# EAGLE design Current_sensor_V1.1 (EAGLE 5.11)
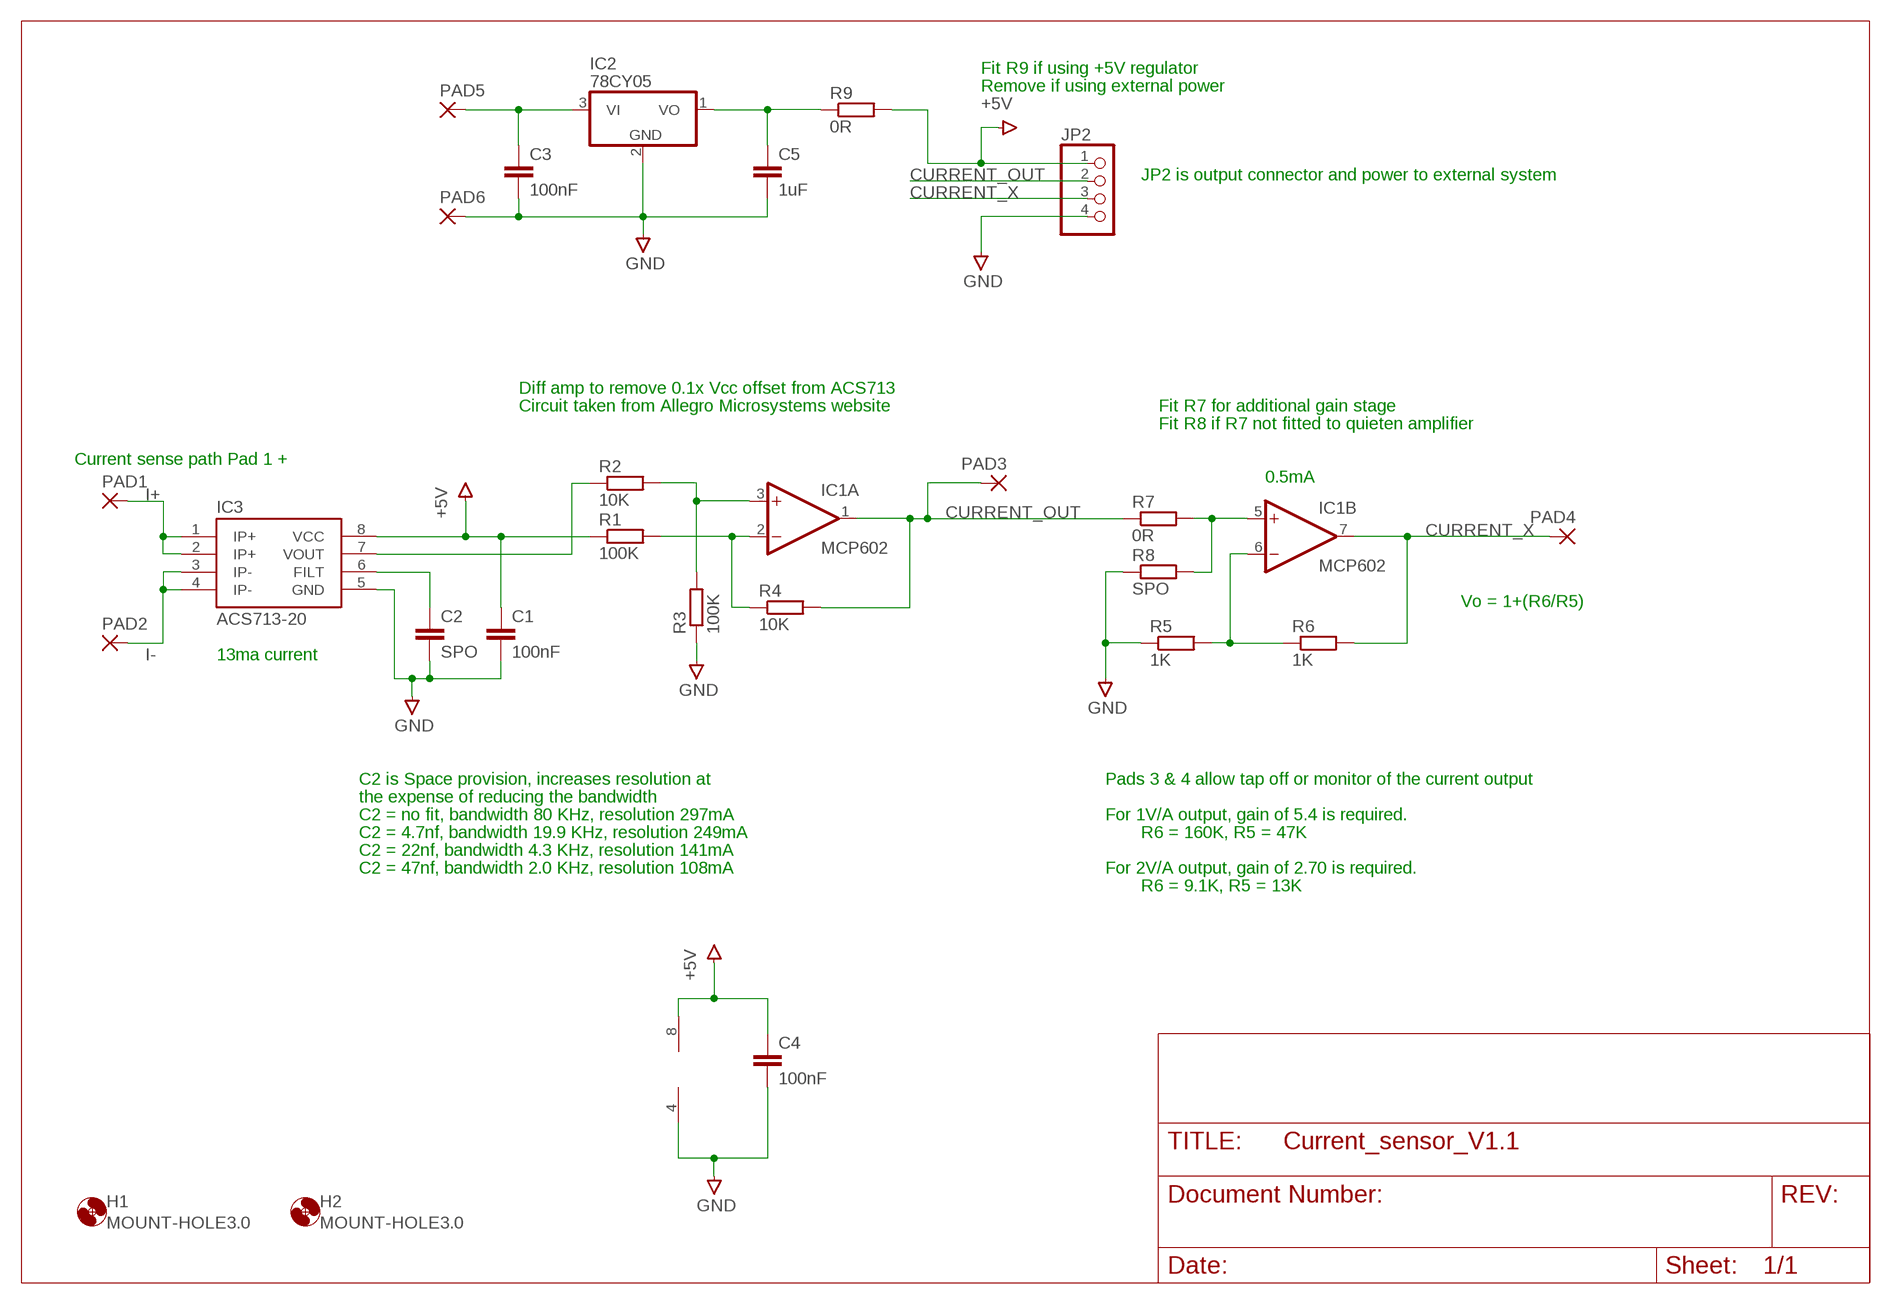
[diagram p0: schematic, sheet 1]

## Parts
C1  100nF  C-EUC0603  [C0603]
C2  SPO  C-EUC0603  [C0603]
C3  100nF  C-EUC0805  [C0805]
C4  100nF  C-EUC0603  [C0603]
C5  1uF  C-EUC0805  [C0805]
H1  MOUNT-HOLE3.0  [3,0]
H2  MOUNT-HOLE3.0  [3,0]
IC1  MCP602  LM358D  [SO08]
IC2  78CY05  78CY  [SOT89]
IC3  ACS713-20  ACS712  [SO08]
JP2  PINHD-1X4  [1X04]
PAD1  3,81/1,4  [3,81/1,4]
PAD2  3,81/1,4  [3,81/1,4]
PAD3  1,6/0,9  [1,6/0,9]
PAD4  1,6/0,9  [1,6/0,9]
PAD5  1,6/0,9  [1,6/0,9]
PAD6  1,6/0,9  [1,6/0,9]
R1  100K  R-EU_R0603  [R0603]
R2  10K  R-EU_R0603  [R0603]
R3  100K  R-EU_R0603  [R0603]
R4  10K  R-EU_R0603  [R0603]
R5  1K  R-EU_R0603  [R0603]
R6  1K  R-EU_R0603  [R0603]
R7  0R  R-EU_R0603  [R0603]
R8  SPO  R-EU_R0603  [R0603]
R9  0R  R-EU_R0805  [R0805]

## Nets
+5V: C1.1 C4.1 IC1.8(P:V+) IC3.8(VCC) JP2.1 R1.1 R9.2
CURRENT_OUT: IC1.1(A:OUT) JP2.2 PAD3.1(P) R4.2 R7.1
CURRENT_X: IC1.7(B:OUT) JP2.3 PAD4.1(P) R6.2
GND: C1.2 C2.2 C3.2 C4.2 C5.2 IC1.4(P:V-) IC2.2(GND) IC3.5(GND) JP2.4 PAD6.1(P) R3.1 R5.1 R8.1
I+: IC3.1(IP+) IC3.2(IP+) PAD1.1(P)
I-: IC3.3(IP-) IC3.4(IP-) PAD2.1(P)
N$1: IC1.2(A:-IN) R1.2 R4.1
N$2: IC1.3(A:+IN) R2.2 R3.2
N$3: C5.1 IC2.1(VO) R9.1
N$4: IC1.5(B:+IN) R7.2 R8.2
N$5: IC3.7(VOUT) R2.1
N$7: C2.1 IC3.6(FILT)
N$10: IC1.6(B:-IN) R5.2 R6.1
N$14: C3.1 IC2.3(VI) PAD5.1(P)

## Notes on the sheet
- Fit R9 if using +5V regulator
- Remove if using external power
- JP2 is output connector and power to external system
- Diff amp to remove 0.1x Vcc offset from ACS713
- Circuit taken from Allegro Microsystems website | Fit R7 for additional gain stage
- Fit R8 if R7 not fitted to quieten amplifier
- Current sense path Pad 1 +
- 0.5mA
- Vo = 1+(R6/R5)
- 13ma current
- C2 is Space provision, increases resolution at | Pads 3 & 4 allow tap off or monitor of the current output
- the expense of reducing the bandwidth
- C2 = no fit, bandwidth 80 KHz, resolution 297mA | For 1V/A output, gain of 5.4 is required.
- C2 = 4.7nf, bandwidth 19.9 KHz, resolution 249mA | R6 = 160K, R5 = 47K
- C2 = 22nf, bandwidth 4.3 KHz, resolution 141mA
- C2 = 47nf, bandwidth 2.0 KHz, resolution 108mA | For 2V/A output, gain of 2.70 is required.
- R6 = 9.1K, R5 = 13K

## Library data of the parts
C1-C5 = rcl:C-EU: CAPACITOR, European symbol
H1 H2 = holes:MOUNT-HOLE: MOUNTING HOLE with drill center marker
IC1 = linear2:LM358: OP AMP
IC2 = IANS:78*: Positive VOLTAGE REGULATOR
IC3 = SparkFun:ACS712
JP2 = pinhead:PINHD-1X4: PIN HEADER
PAD1 PAD2 = wirepad:3,81/1,4: THROUGH-HOLE PAD
PAD3-PAD6 = wirepad:1,6/0,9: THROUGH-HOLE PAD
R1-R9 = rcl:R-EU_: RESISTOR, European symbol

## Board
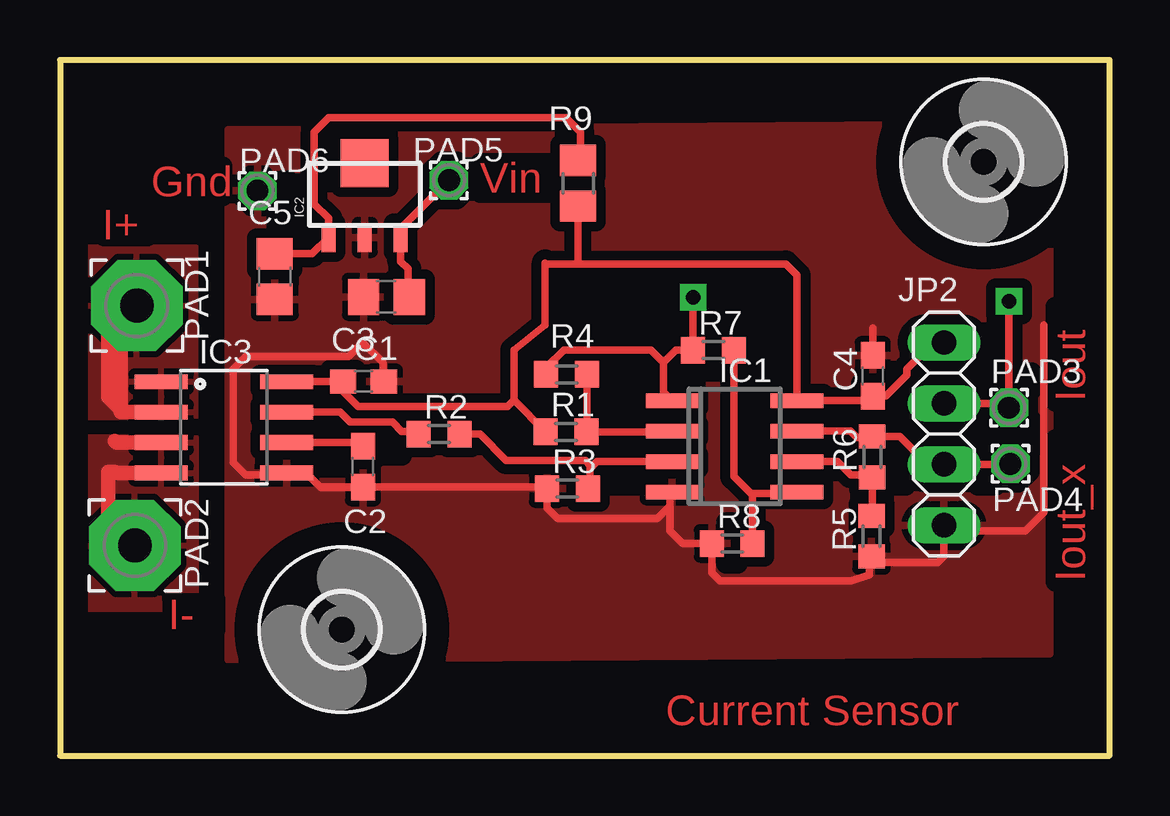
[diagram p1: board, top side]
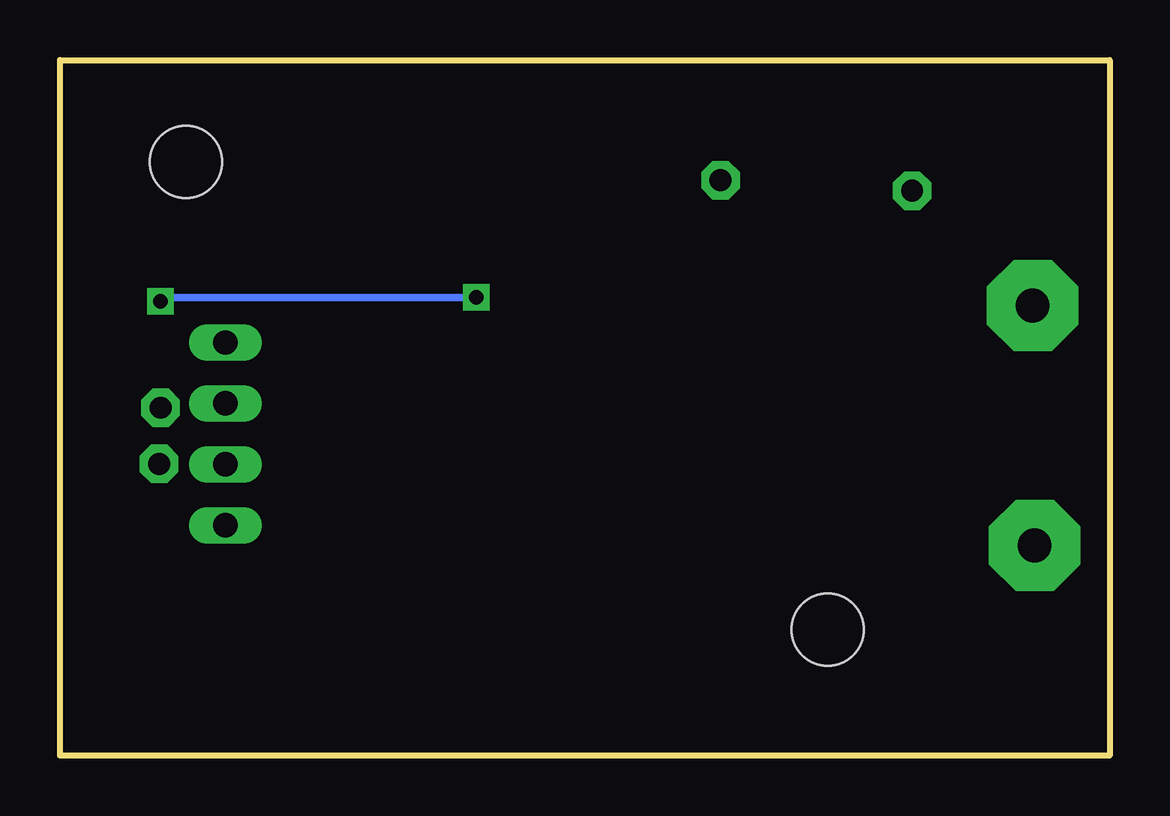
[diagram p2: board, bottom side, seen from below]

Size 43.75 x 29 mm. Coordinates in mm from the lower left corner, seen from the top.
Outline: 0,0 43.75,0 43.75,29 0,29 0,0
Copper layers (1*16): Top 0.035mm / dielectric 1.5mm / Bottom 0.035mm
Design rules "homepcb": minimum track width 10mil, minimum drill 20mil, track to track 10mil, track to pad 10mil, pad to pad 10mil, via to via 10mil, smd to smd 10mil, copper to edge 40mil, drill to drill 10mil, minimum pad ring 10mil, minimum via ring 10mil, stop-mask expansion 0mil, vias tented up to drill 0mil, thermal gap 10mil
tRestrict: area 9,22 to 9.2,22.2; area 9.2,22 to 9.5,24; area 10.8,12.2 to 11.8,12.5; area 10.8,12 to 12,12.2; area 13.5,12.5 to 14.2,12.8; area 22.8,11.2 to 24.2,11.5; area 27,16 to 27.5,16.2; area 34.8,11.2 to 35.2,11.5; area 38.2,11.2 to 39,11.5; area 40.2,12.8 to 40.5,14; area 40.2,15.2 to 40.5,16; area 27.8,8 to 28.2,8.2; 1 more areas

### Footprints (pad centres in the part's own frame; a part is rotated, then mirrored left to right if it is on the bottom)
C0603 = smd 1.1 x 1: 1 -0.85,0; 2 0.85,0
C0805 = smd 1.3 x 1.5: 1 -0.95,0; 2 0.95,0
3,0 = hole 3: 0,0
SO08 = smd 0.6 x 2.2: 1 -1.905,-2.6; 2 -0.635,-2.6; 3 0.635,-2.6; 4 1.905,-2.6; 5 1.905,2.6; 6 0.635,2.6; 7 -0.635,2.6; 8 -1.905,2.6
SOT89 = smd 0.58 x 1.2: 1 -1.5,-1.8; 2 0,-1.8; 3 1.5,-1.8 | smd 2 x 2: 4 0,1.3
SO08' = smd 0.61 x 2.21: 1 -1.905,-2.616; 2 -0.635,-2.616; 3 0.635,-2.616; 4 1.905,-2.616; 5 1.905,2.616; 6 0.635,2.616; 7 -0.635,2.616; 8 -1.905,2.616
1X04 = drill 1.016 long: 1 -3.81,0; 2 -1.27,0; 3 1.27,0; 4 3.81,0
3,81/1,4 = drill 1.397 pad 3.81 octagon: 1 0,0
1,6/0,9 = drill 0.914 pad 1.6 octagon: 1 0,0
R0603 = smd 1 x 1.1: 1 -0.85,0; 2 0.85,0
R0805 = smd 1.3 x 1.5: 1 -0.95,0; 2 0.95,0

### Placement (x,y rotation side)
C1  12.65,15.59 0 top
C2  12.62,12.05 270 top
C3  13.61,19.12 180 top
C4  33.88,15.83 90 top
C5  8.96,19.97 270 top
H1  11.75,5.25 0 top
H2  38.5,24.75 0 top
IC1  28.12,12.89 270 top
IC2  12.7,23.4 0 top
IC3  ACS713-20  [SO08']  6.84,13.68 270 top
JP2  36.85,13.41 270 top
PAD1  3.2,18.76 0 top
PAD2  3.12,8.76 0 top
PAD3  39.56,14.5 0 top
PAD4  39.62,12.16 0 top
PAD5  16.21,23.98 0 top
PAD6  8.23,23.55 0 top
R1  21.09,13.5 0 top
R2  15.8,13.4 0 top
R3  21.15,11.13 0 top
R4  21.12,15.89 180 top
R5  33.83,9.15 90 top
R6  33.86,12.45 90 top
R7  27.24,16.9 0 top
R8  28.02,8.84 0 top
R9  21.6,23.86 270 top

### Tracks (layer width: path | path; a pad name or v marks a point on that pad's centre or on a via)
+5V
  Top 0.305: IC3.8 C1.1 11.8,15.18 12.42,14.56 18.66,14.56 18.92,14.82 | R1.1 18.92,14.82 | 18.92,14.82 18.92,16.9 20.22,17.94 20.22,20.54 20.26,20.5 21.7,20.5 | JP2.1 36.79,17.16 36.34,17.16 35.3,16.12 35.3,15.86 34.42,14.98 C4.1 33.7,14.8 IC1.8 30.72,20.03 30.25,20.5 21.7,20.5 | R9.2 21.6,20.6 21.7,20.5
CURRENT_OUT  (via drill 0.6)
  Top 0.305: 25.16,16.38 25.68,16.9 R7.1 v26.39,19.09 v26.4,19.1 | 25.16,16.38 25.16,15.16 IC1.1 | R4.2 20.27,16.17 21,16.9 24.64,16.9 25.16,16.38 | JP2.2 39.38,14.68 PAD3.1 | PAD3.1 39.7,14.64 | v39.56,18.94 PAD3.1
  Bottom 0.305: v26.4,19.1 39.7,19.1 v39.56,18.94
CURRENT_X
  Top 0.305: IC1.7 32.95,13.52 33.22,13.26 33.82,13.26 R6.2 35,13.3 36.08,12.22 36.77,12.22 JP2.3 39.6,12.14 PAD4.1
GND
  Top 0.305: C1.2 13.46,15.63 13.46,16.38 12.62,17.22 12.04,16.64 7.74,16.64 7.22,16.12 7.22,12.22 7.74,11.7 10.34,11.7 | IC3.5 10.26,11.78 10.34,11.7 | 10.85,11.2 10.86,11.18 12.61,11.18 C2.2 | C2.2 20.23,11.2 R3.1 20.3,10.32 20.74,9.88 24.9,9.88 25.42,10.4 | 25.42,10.4 25.42,10.89 IC1.4 | 25.42,10.4 25.42,9.36 25.94,8.84 R8.1 27.17,7.61 27.5,7.28 32.96,7.28 33.74,7.54 33.74,8.21 R5.1 34.07,8.06 36.6,8.06 36.85,8.31 JP2.4 37.09,9.36 40.24,9.36 41.02,10.14 41.02,17.94 | C4.2 33.88,17.82 | 10.85,11.2 C2.2 | 10.34,11.7 10.85,11.2
  pour Top (isolate 0.406): 7,26.1 41.25,26.35 41.25,4.25 7,4
I+
  Top 0.406: 2.54,14.32 2.5,14.32
  Top 0.61: 2.54,14.32 2.54,18.84 | IC3.2 2.64,14.32 2.02,14.94 2.02,17.58 PAD1.1
  pour Top: 5.66,14.12 5.66,21.18 0.72,21.18 0.72,14.12
I-
  Top 0.406: 3.84,11.78 IC3.4 | IC3.3 4.22,13.12
  Top 0.61: 3.84,11.78 2.32,11.78 2.28,11.82 2.02,11.82 2.02,10 3.06,8.96 3.06,8.44 | IC3.3 2.35,13.05 2.28,13.12
  Top 1.016: 2.28,8.44 3.06,8.44 3.84,8.44
  pour Top: 5.66,13.28 5.66,6.1 0.72,6.1 0.72,13.28
N$1
  Top 0.305: IC1.2 25.49,13.5 R1.2 21.97,13.52 R4.1
N$2
  Top 0.305: R2.2 17.5,13.4 18.6,12.3 21.9,12.3 22.1,12.1 22.1,11.96 | 22.1,11.96 22.1,11.23 R3.2 | IC1.3 22.39,12.25 22.1,11.96
N$3
  Top 0.305: C5.1 10.52,20.92 IC2.1 11.2,22.4 10.6,23 10.6,26 11.2,26.6 21.1,26.6 21.7,26 21.7,24.91 R9.1
N$4
  Top 0.305: R7.2 28.09,11.63 28.8,10.92 | 28.8,10.92 30.66,10.92 IC1.5 | R8.2 28.87,10.85 28.8,10.92
N$5
  Top 0.305: R2.1 14.84,13.52 14.24,13.52 13.86,13.9 12.1,13.9 11.68,14.32 IC3.7
N$7
  Top 0.305: IC3.6 12.47,13.05 C2.1
N$10
  Top 0.305: IC1.6 32.41,12.25 32.96,11.7 33.76,11.7 R6.1 33.86,10.03 R5.2
N$14
  Top 0.305: PAD5.1 14.2,21.97 IC2.3 14.2,20.6 14.5,20.3 14.5,19.48 C3.1

### Text on the board
Top: Gnd | Vin | I+ | Iout | Iout_x | I- | Current Sensor